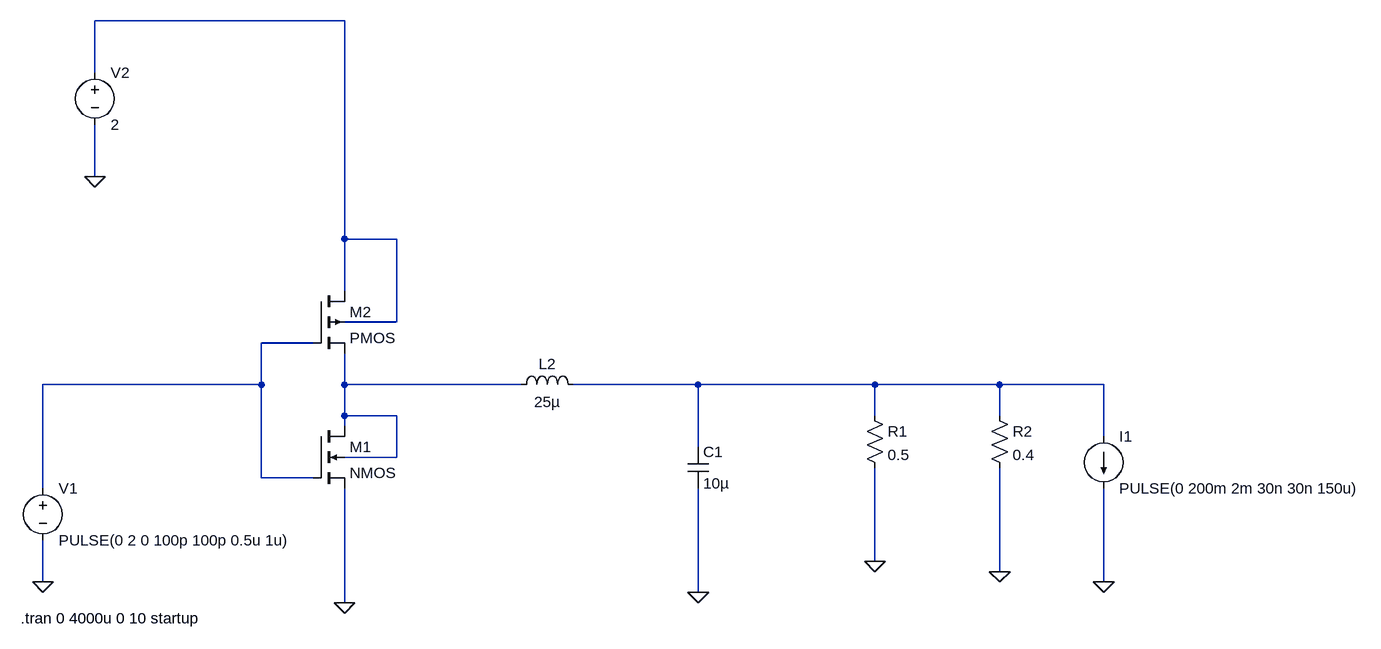
[diagram p0: schematic HW.asc]
HW.asc, the LTspice schematic file:
Version 4
SHEET 1 1764 680
WIRE 176 -320 -208 -320
WIRE -208 -240 -208 -320
WIRE -208 -80 -208 -160
WIRE 176 16 176 -320
WIRE 256 16 176 16
WIRE 176 96 176 16
WIRE 256 144 256 16
WIRE 256 144 176 144
WIRE 128 176 48 176
WIRE 48 240 48 176
WIRE 48 240 -288 240
WIRE 176 240 176 192
WIRE 448 240 176 240
WIRE 720 240 528 240
WIRE 992 240 720 240
WIRE 1184 240 992 240
WIRE 1344 240 1184 240
WIRE 176 288 176 240
WIRE 256 288 176 288
WIRE 992 288 992 240
WIRE 1184 288 1184 240
WIRE 176 304 176 288
WIRE 1344 320 1344 240
WIRE 720 336 720 240
WIRE 256 352 256 288
WIRE 256 352 176 352
WIRE 48 384 48 240
WIRE 128 384 48 384
WIRE -288 400 -288 240
WIRE 992 512 992 368
WIRE 1184 528 1184 368
WIRE -288 544 -288 480
WIRE 1344 544 1344 400
WIRE 720 560 720 400
WIRE 176 576 176 400
FLAG -288 544 0
FLAG 176 576 0
FLAG 720 560 0
FLAG 992 512 0
FLAG -208 -80 0
FLAG 1184 528 0
FLAG 1344 544 0
SYMBOL voltage -288 384 R0
WINDOW 123 0 0 Left 0
WINDOW 39 0 0 Left 0
SYMATTR InstName V1
SYMATTR Value PULSE(0 2 0 100p 100p 0.5u 1u)
SYMBOL voltage -208 -256 R0
WINDOW 123 0 0 Left 0
WINDOW 39 0 0 Left 0
SYMATTR InstName V2
SYMATTR Value 2
SYMBOL ind 432 256 R270
WINDOW 0 32 56 VTop 2
WINDOW 3 5 56 VBottom 2
SYMATTR InstName L2
SYMATTR Value 25µ
SYMBOL cap 704 336 R0
SYMATTR InstName C1
SYMATTR Value 10µ
SYMBOL res 976 272 R0
SYMATTR InstName R1
SYMATTR Value 0.5
SYMBOL nmos4 128 304 R0
SYMATTR InstName M1
SYMATTR Value2 l=180n w=50m
SYMBOL pmos4 128 96 R0
SYMATTR InstName M2
SYMATTR Value2 l=180n w=100m
SYMBOL res 1168 272 R0
SYMATTR InstName R2
SYMATTR Value 0.4
SYMBOL current 1344 320 R0
WINDOW 123 0 0 Left 0
WINDOW 39 0 0 Left 0
SYMATTR InstName I1
SYMATTR Value PULSE(0 200m 2m 30n 30n 150u)
TEXT -322 600 Left 2 !.tran 0 4000u 0 10 startup

The netlist it stands for:
* HW.asc
V1 N002 0 PULSE(0 2 0 100p 100p 0.5u 1u)
V2 N001 0 2
L2 N003 N004 25µ
C1 N004 0 10µ
R1 N004 0 0.5
M1 N003 N002 0 N003 NMOS l=180n w=50m
M2 N001 N002 N003 N001 PMOS l=180n w=100m
R2 N004 0 0.4
I1 N004 0 PULSE(0 200m 2m 30n 30n 150u)
.model NMOS NMOS
.model PMOS PMOS
.lib standard.mos
.tran 0 4000u 0 10 startup
.backanno
.end